# Altium schematic sheet gydrodrive_indication.SchDoc
size 297 x 209 mm; SheetNumber: 10; SheetTotal: 22
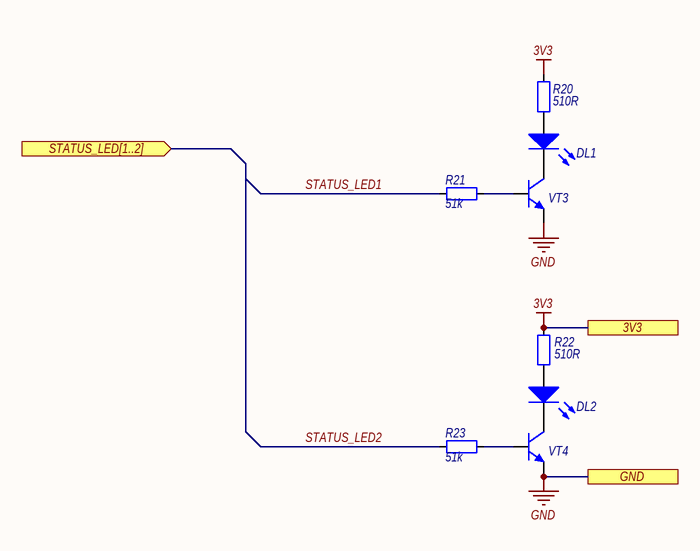
[diagram p0: gydrodrive_indication.SchDoc]

## Parts
DL1  LED_0805  [LEDC2012-0805M]  (value not drawn)
DL2  LED_0805  [LEDC2012-0805M]  (value not drawn)
R20  Resistance: 510R  [RESC2012-0805M]  (hidden comment: RES_0805)
R21  Resistance: 51k  [RESC2012-0805M]  (hidden comment: RES_0805)
R22  Resistance: 510R  [RESC2012-0805M]  (hidden comment: RES_0805)
R23  Resistance: 51k  [RESC2012-0805M]  (hidden comment: RES_0805)
VT3  BC817  [SOT23-3M]  (value not drawn)
VT4  BC817  [SOT23-3M]  (value not drawn)

## Ports
3V3 (see gydrodrive_main[4B], gydrodrive_button[3B], gydrodrive_can[3B], gydrodrive_debugger[3B], gydrodrive_encoder[1A], gydrodrive_inputTrim[4B], gydrodrive_interfaces[3C], gydrodrive_mcu[4C], gydrodrive_rs485[4B], gydrodrive_sto[2B], gydrodrive_supply[5B]), GND (see gydrodrive_main[4B], gydrodrive_button[3C], gydrodrive_can[3C], gydrodrive_control[3B], gydrodrive_currentSource[2B], gydrodrive_debugger[4C], gydrodrive_discreteControl[3B], gydrodrive_encoder[1B], gydrodrive_i2c[5C], gydrodrive_inputTrim[4C], gydrodrive_interfaces[3A], gydrodrive_linearPosSensor[2C], gydrodrive_mcu[6D], gydrodrive_reservedPins[2C], gydrodrive_rs485[3B], gydrodrive_sensor[3C], gydrodrive_sensors[2B], gydrodrive_sto[2C], gydrodrive_supply[2C], gydrodrive_uart[4C]), STATUS_LED[1..2] (in, see gydrodrive_main[3B], gydrodrive_mcu[1B])

## Nets
3V3: R20.1 R22.1 ; port 3V3
GND: VT3.2(E) VT4.2(E) ; port GND
STATUS_LED1: R21.2
STATUS_LED2: R23.2
NetDL1_1: DL1.1(K) VT3.3(C)
NetDL1_2: DL1.2(A) R20.2
NetDL2_1: DL2.1(K) VT4.3(C)
NetDL2_2: DL2.2(A) R22.2
NetR21_1: R21.1 VT3.1(B)
NetR23_1: R23.1 VT4.1(B)

## Notes on the sheet
- Подп. и дата
- Инв. № дубл.
- Взам. инв. №
- Инв. № подл.
- Изм.
- Лист
- № докум.
- Подп.
- Дата
- Копировал
- Формат
- A4

## Library data of the parts
DL1 DL2 = LED_0805: Светодиод smd, корпус 0805; Part Name: Светодиод smd 0805; Parameters: Желтый; Max Price: 0; Part Number: LED_0805; Component Type: Standart; Pin Count: 2
R20 R22 = RESC_0805: Рез-р, корпус 0805; Tolerance: 5%; Parameters: 510R, 5%; Max Price: 3; Part Number: RESC_0805; Part Name: ='Рез-р 0805, ' + Parameters; Component Type: Standart
R21 R23 = RESC_0805: Рез-р, корпус 0805; Tolerance: 5%; Parameters: 51k, 5%; Max Price: 3; Part Number: RESC_0805; Part Name: ='Рез-р 0805, ' + Parameters; Component Type: Standart
VT3 VT4 = BC817: Биполярный транзистор; Part Name: Транзистор BC817; Parameters: 45V, 0.5A; Voltage: 45V; Current: 500 mA; Max Price: 20; Part Number: BC817; Component Type: Standart